# Altium schematic sheet encoder.SchDoc
size A
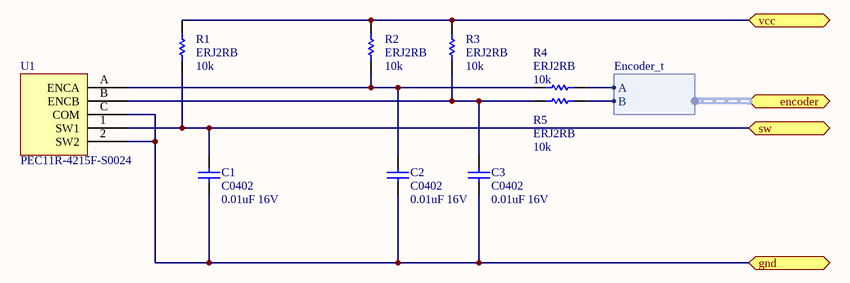
[diagram p0: encoder.SchDoc]

## Parts
C1  C0402  value 0.01uF 16V  [0402]
C2  C0402  value 0.01uF 16V  [0402]
C3  C0402  value 0.01uF 16V  [0402]
R1  ERJ2RB  value 10k  [2-0402]
R2  ERJ2RB  value 10k  [2-0402]
R3  ERJ2RB  value 10k  [2-0402]
R4  ERJ2RB  value 10k  [2-0402]
R5  ERJ2RB  value 10k  [2-0402]
U1  PEC11R-4215F-S0024  [PCBComponent_1]

## Ports
encoder (harness Encoder_t), gnd, sw, vcc

## Harnesses
Encoder_t: A, B

## Nets
gnd: C1.2 C2.2 C3.2 U1.2(SW2) U1.C(COM) ; port gnd
sw: C1.1 R1.1 U1.1(SW1) ; port sw
vcc: R1.2 R2.2 R3.2 ; port vcc
NetC2_1: C2.1 R2.1 R4.2 U1.A(ENCA)
NetC3_1: C3.1 R3.1 R5.2 U1.B(ENCB)
NetR4_1: R4.1 ; port encoder.A
NetR5_1: R5.1 ; port encoder.B

## Library data of the parts
C1-C3 = C0402: Ceramic Chip Capacitor - Standard; Note: Footprint corresponds to dimensions for bulk cassette packaging. This case size has tightened tolerances.; Published: 17-Jul-2002; LatestRevisionDate: 19-Mar-2004; LatestRevisionNote: Silkscreen size reduced.; DatasheetDocument: Mar-2001; PackageDocument: Mar-2001; PackageReference: 0402; Publisher: Altium Limited; Code_JEITA: 0402; Code_IPC: 1005 [0402]; ComponentLink1Description: Manufacturer Link; ComponentLink1URL: http://www.kemet.com/; ComponentLink2Description: Datasheet; ComponentLink2URL: http://www.kemet.com/kemet/web/homepage/kechome.nsf/vapubfilesname/F3102TA.pdf/$file/F3102TA.pdf
R1-R5 = ERJ2RB: Precision Thick Film Chip Resistor, 10 Ohm to 1M Ohm Range, 1% and 0.5% Tolerance, 0402 Size, 0.063 W; Published: 17-Dec-2003; LatestRevisionDate: 19-Mar-2004; LatestRevisionNote: Silkscreen size reduced.; PackageDocument: Mar-2003; PackageReference: 2-0402; Publisher: Altium Limited; Code_IPC: 1005 [0402]; ComponentLink1Description: Manufacturer Link; ComponentLink1URL: http://www.panasonic.com/industrial/components/resistive_products.htm; ComponentLink2Description: Datasheet; ComponentLink2URL: http://www.panasonic.com/industrial/components/pdf/AOA0000CE2.pdf
U1 = Component_1: PEC11R-4xxxF-Sxxxx; Manufacturer: Bourns; ManufacturerPartNumber: PEC11R-4215F-S0024